# Altium schematic sheet Reefing-PD.SchDoc: Reefing System
size A4; DocumentNumber: Subtitle; Revision: V1.0; SheetNumber: 5; SheetTotal: 13; Author: Luca Jost; Subtitle: Power Distribution
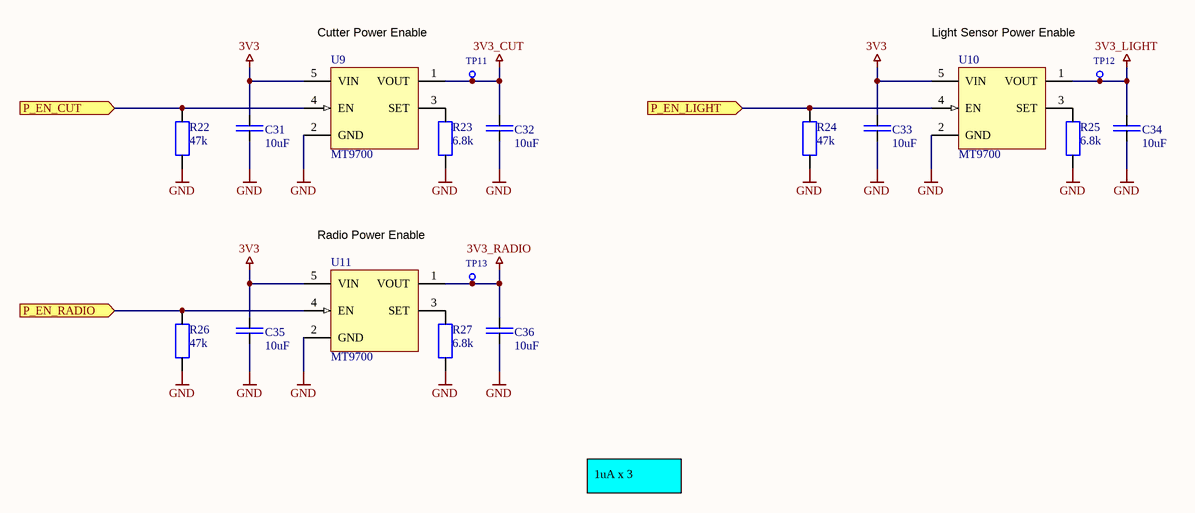
[diagram p0: Reefing-PD.SchDoc]

## Parts
C31  10uF  [SMD Keramikkondensator 0805]
C32  10uF  [SMD Keramikkondensator 0805]
C33  10uF  [SMD Keramikkondensator 0805]
C34  10uF  [SMD Keramikkondensator 0805]
C35  10uF  [SMD Keramikkondensator 0805]
C36  10uF  [SMD Keramikkondensator 0805]
R22  47k  [SMD Widerstand 0805]
R23  6.8k  [SMD Widerstand 0805]
R24  47k  [SMD Widerstand 0805]
R25  6.8k  [SMD Widerstand 0805]
R26  47k  [SMD Widerstand 0805]
R27  6.8k  [SMD Widerstand 0805]
TP11  X-TP  [SMD Testpunkt Ø1mm]  (value not drawn)  (no BOM)
TP12  X-TP  [SMD Testpunkt Ø1mm]  (value not drawn)  (no BOM)
TP13  X-TP  [SMD Testpunkt Ø1mm]  (value not drawn)  (no BOM)
U9  MT9700  [SMD IC SOT-23-5]
U10  MT9700  [SMD IC SOT-23-5]
U11  MT9700  [SMD IC SOT-23-5]

## Ports
P_EN_CUT (in), P_EN_LIGHT (in), P_EN_RADIO (in)

## Nets
3V3: C31.2 C33.2 C35.2 U9.5(VIN) U10.5(VIN) U11.5(VIN)
3V3_CUT: C32.2 TP11.1 U9.1(VOUT)
3V3_LIGHT: C34.2 TP12.1 U10.1(VOUT)
3V3_RADIO: C36.2 TP13.1 U11.1(VOUT)
GND: C31.1 C32.1 C33.1 C34.1 C35.1 C36.1 R22.1 R23.1 R24.1 R25.1 R26.1 R27.1 U9.2(GND) U10.2(GND) U11.2(GND)
P_EN_CUT: R22.2 U9.4(EN) ; port P_EN_CUT
P_EN_LIGHT: R24.2 U10.4(EN) ; port P_EN_LIGHT
P_EN_RADIO: R26.2 U11.4(EN) ; port P_EN_RADIO
NetR23_2: R23.2 U9.3(SET)
NetR25_2: R25.2 U10.3(SET)
NetR27_2: R27.2 U11.3(SET)

## Notes on the sheet
- Cutter Power Enable
- Light Sensor Power Enable
- Radio Power Enable
- 1uA x 3
- Title
- Author:
- Subtitle
- Date:
- Rev:
- File:
- Sheet
- of

## Library data of the parts
C31-C36 = E6 - 10uF: SMD Ceramic Capacitor E6; Unit Price: 0.01; Number: -; Supplier: -
R22 R24 R26 = E24 - 47k: SMD Chip Resistor E24; Unit Price: 0.01; Number: -; Supplier: -
R23 R25 R27 = E24 - 6.8k: SMD Chip Resistor E24; Unit Price: 0.01; Number: -; Supplier: -
TP11-TP13 = X-TP: Testpunkt; Component Value: Ø 0.8mm; Component Description: Testpoint; Unit Price: 0.00
U9-U11 = MT9700: Power Distribution Switch; ComponentLink1Description: Datasheet; ComponentLink1URL: https://datasheet.lcsc.com/lcsc/1809291208_XI-AN-Aerosemi-Tech-MT9700_C89855.pdf; JLC: C89855